# Altium schematic sheet Circuit_A.SchDoc
size A4; SheetNumber: 2; SheetTotal: 8
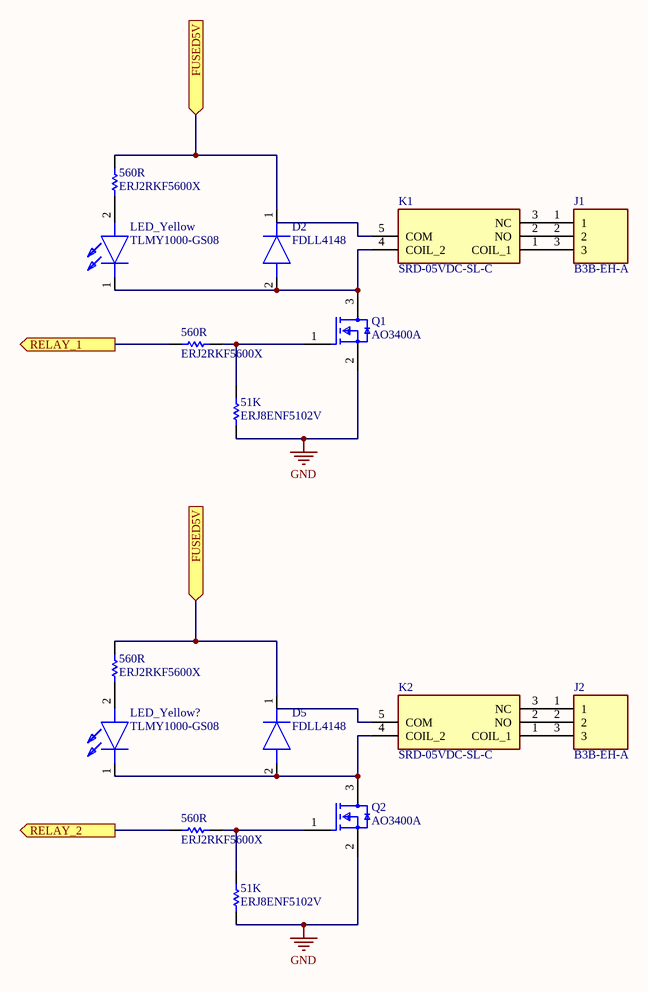
[diagram p0: Circuit_A.SchDoc]

## Parts
(Parts that share a designator on the sheet are numbered #1, #2 ... from top to bottom, then left to right.)
51K#1  ERJ8ENF5102V  [RESC3216X70X50NL05T20]
51K#2  ERJ8ENF5102V  [RESC3216X70X50NL05T20]
560R#1  ERJ2RKF5600X  [RESC1005X40X25LL05T05]
560R#2  ERJ2RKF5600X  [RESC1005X40X25LL05T05]
560R#3  ERJ2RKF5600X  [RESC1005X40X25LL05T05]
560R#4  ERJ2RKF5600X  [RESC1005X40X25LL05T05]
D2  FDLL4148  [FDLL4448]
D5  FDLL4148  [FDLL4448]
J1  B3B-EH-A  [SHDR3W64P0X250_1X3_1000X380X600P]
J2  B3B-EH-A  [SHDR3W64P0X250_1X3_1000X380X600P]
K1  SRD-05VDC-SL-C  [SRD05VDCSLC]
K2  SRD-05VDC-SL-C  [SRD05VDCSLC]
LED_Yellow  TLMY1000-GS08  [LEDC1608X65N]
LED_Yellow?  TLMY1000-GS08  [LEDC1608X65N]
Q1  AO3400A  [FP-SOT23-MFG]
Q2  AO3400A  [FP-SOT23-MFG]

## Ports
FUSED5V (in, see CANBUS[2B], CANBUS[2C], CANBUS[3B], Circuit_A[2A], RS-485[3B]), FUSED5V (in, see CANBUS[2B], CANBUS[2C], CANBUS[3B], Circuit_A[2C], RS-485[3B]), RELAY_1 (out), RELAY_2 (out)

## Nets
GND: 51K#1.1 51K#2.1 Q1.2(S) Q2.2(S)
FUSED5V: 560R#1.1 560R#3.1 D2.1(K) D5.1(K) ; port FUSED5V
RELAY_1: 560R#2.1 ; port RELAY_1
RELAY_2: 560R#4.1 ; port RELAY_2
Net51K#1_2: 51K#1.2 560R#2.2 Q1.1(G)
Net51K#2_2: 51K#2.2 560R#4.2 Q2.1(G)
Net560R#1_2: 560R#1.2 LED_Yellow.2(A)
Net560R#3_2: 560R#3.2 LED_Yellow?.2(A)
NetD2_2: D2.2(A) K1.4(COIL_2) LED_Yellow.1(K) Q1.3(D)
NetD5_2: D5.2(A) K2.4(COIL_2) LED_Yellow?.1(K) Q2.3(D)
NetJ1_1: J1.1 K1.3(NC)
NetJ1_2: J1.2 K1.2(NO)
NetJ1_3: J1.3 K1.1(COIL_1)
NetJ2_1: J2.1 K2.3(NC)
NetJ2_2: J2.2 K2.2(NO)
NetJ2_3: J2.3 K2.1(COIL_1)

Not connected (* = marked no-connect by the designer): K1 5(COM); K2 5(COM)

## Library data of the parts
51K#1 51K#2 = CMP-2003-00854-1: Manufacturer: Panasonic; Part Number: ERJ8ENF5102V
560R#1-560R#4 = CMP-2002-01159-2: Chip Resistor, 560 Ohm, +/- 1%, 0.1 W, -55 to 155 degC, 0402 (1005 Metric), RoHS, Tape and Reel; Resistance: 560 Ohm; Voltage Rating: 50 V; Power Rating: 100 mW; Case\Package: 0402; Mounting Technology: Surface Mount; PackageDescription: 2-Pin Surface Mount Device, Body 1 x 0.5 mm; RoHSCompliant: true; ComponentLink1URL: http://www.panasonic.com/; Tolerance: 1%; REACH SVHC: Yes; Height: 0.35 mm; ComponentLink2Description: Datasheet; ComponentLink2URL: http://industrial.panasonic.com/cdbs/www-data/pdf/RDA0000/AOA0000C86.pdf; Radiation Hardening: No; Pins: 2; DatasheetVersion: 04/2015; Min Operating Temperature: -55 degC; Length: 1 mm; Case Code (Imperial): 0402; Packaging: Tape and Reel; Max Operating Temperature: 155 degC; ComponentLink1Description: Manufacturer URL; Mount: Surface Mount; Width: 0.5 mm; Case Code (Metric): 1005; Package Quantity: 10000; PackageReference: 0402
D2 D5 = FDLL4148: Diode; Manufacturer_Name: onsemi; Height: 1mm; Manufacturer_Part_Number: FDLL4148; Mouser Part Number: 512-FDLL4148; Mouser Price/Stock: https://www.mouser.co.uk/ProductDetail/onsemi-Fairchild/FDLL4148?qs=GXJjH%252BIVz3Nb7%252BJnJig0Zw%3D%3D; Arrow Part Number: FDLL4148; Arrow Price/Stock: https://www.arrow.com/en/products/fdll4148/on-semiconductor?region=europe
J1 J2 = B3B-EH-A: Connector; Manufacturer_Name: JST (JAPAN SOLDERLESS TERMINALS); Datasheet Link: https://datasheet.datasheetarchive.com/originals/dk/DKDS-2/32954.pdf; Height: 6mm; Manufacturer_Part_Number: B3B-EH-A
K1 K2 = SRD-05VDC-SL-C: Relay or Contactor; Manufacturer_Name: EAGLE; Datasheet Link: http://www.songlerelay.com/Public/Uploads/20161104/581c81ac16e36.pdf; Height: 15.8mm; Manufacturer_Part_Number: SRD-05VDC-SL-C
LED_Yellow LED_Yellow? = TLMY1000-GS08: LED; Manufacturer_Name: Vishay; Datasheet Link: https://componentsearchengine.com/Datasheets/1/TLMY1000-GS08.pdf; Height: 0.65mm; Manufacturer_Part_Number: TLMY1000-GS08; Mouser Part Number: 78-TLMY1000; Mouser Price/Stock: https://www.mouser.co.uk/ProductDetail/Vishay-Semiconductors/TLMY1000-GS08?qs=oNDV51lhjEPokOtwpRQ6JA%3D%3D; Arrow Part Number: TLMY1000-GS08; Arrow Price/Stock: https://www.arrow.com/en/products/tlmy1000-gs08/vishay?region=nac
Q1 Q2 = CMP-83955-000006-1: MOSFET N-CH 30V 5.7A SOT23; Input Capacitance: 630pF; Number of Elements: 1; Rds On Max: 26.5mR; Max Power Dissipation: 1.4W; Gate to Source Voltage (Vgs): 12V; Min Operating Temperature: -55°C; Lead Free: Lead Free; Number of Pins: 3; Drain to Source Voltage (Vdss): 30V; Case/Package: SOT-23; Mount: Surface Mount; Continuous Drain Current (ID): 5.7A; Radiation Hardening: No; Packaging: Tape and Reel; Max Operating Temperature: 150°C; Power Dissipation: 1.4W